# EAGLE design PidiBoy (EAGLE 9.2.0)
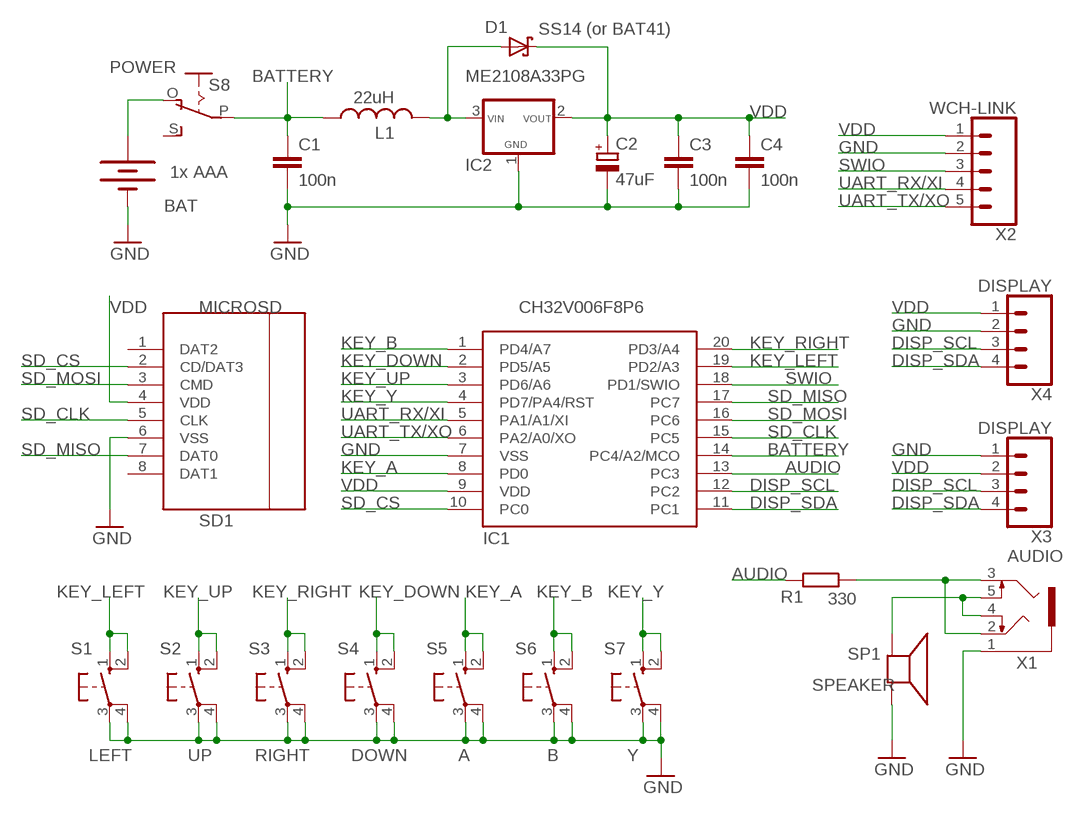
[diagram p0: schematic, sheet 1]

## Parts
BAT  1x AAA  BATTERY-AAA_KIT  [BATTERY-AAA-KIT]
C1  100n  C-EU050-024X044  [C050-024X044]
C2  47uF  CPOL-EUE2-5  [E2-5]
C3  100n  C-EU050-024X044  [C050-024X044]
C4  100n  C-EU050-024X044  [C050-024X044]
D1  SS14 (or BAT41)  SCHOTTKY-DIODEDO35-7  [DO35-7]
IC1  CH32V006F8P6  [TSSOP20]
IC2  ME2108A33PG  [SOT89-R]
L1  22uH  L-USWE-TPC  [POWER-CHOKE_WE-TPC]
R1  330  R-EU_0204/7  [0204/7]
S1  LEFT  10-XX  [B3F-10XX]
S2  UP  10-XX  [B3F-10XX]
S3  RIGHT  10-XX  [B3F-10XX]
S4  DOWN  10-XX  [B3F-10XX]
S5  A  10-XX  [B3F-10XX]
S6  B  10-XX  [B3F-10XX]
S7  Y  10-XX  [B3F-10XX]
S8  POWER  EG1218S  [EG1218]
SD1  MICROSD  [MICROSD]
SP1  SPEAKER  SPEAKER/AL60P  [AL60P]
X1  AUDIO  1503_09  [1503_09]
X2  WCH-LINK  CONN_05PTH_LONGPADS  [1X05_LONGPADS]
X3  DISPLAY  CONN_04  [1X04]
X4  DISPLAY  CONN_04  [1X04]

## Nets
AUDIO: IC1.13(PC3) R1.2
BATTERY: C1.1 IC1.14(PC4/A2/MCO) L1.1 S8.P
DISP_SCL: IC1.12(PC2) X3.3 X4.3
DISP_SDA: IC1.11(PC1) X3.4 X4.4
GND: BAT.GND@1(-) C1.2 C2.- C3.2 C4.2 IC1.7(VSS) IC2.1(GND) S1.3(P) S1.4(P1) S2.3(P) S2.4(P1) S3.3(P) S3.4(P1) S4.3(P) S4.4(P1) S5.3(P) S5.4(P1) S6.3(P) S6.4(P1) S7.3(P) S7.4(P1) SD1.6(VSS) SP1.2(-) X1.1 X2.2 X3.1 X4.2
KEY_A: IC1.8(PD0) S5.1(S) S5.2(S1)
KEY_B: IC1.1(PD4/A7) S6.1(S) S6.2(S1)
KEY_DOWN: IC1.2(PD5/A5) S4.1(S) S4.2(S1)
KEY_LEFT: IC1.19(PD2/A3) S1.1(S) S1.2(S1)
KEY_RIGHT: IC1.20(PD3/A4) S3.1(S) S3.2(S1)
KEY_UP: IC1.3(PD6/A6) S2.1(S) S2.2(S1)
KEY_Y: IC1.4(PD7/PA4/RST) S7.1(S) S7.2(S1)
N$2: SP1.1(+) X1.4 X1.5
N$3: BAT.PWR@1(+) S8.O
N$4: D1.A IC2.3(IN) L1.2
N$7: R1.1 X1.2 X1.3
SD_CLK: IC1.15(PC5) SD1.5(CLK)
SD_CS: IC1.10(PC0) SD1.2(CD/DAT3)
SD_MISO: IC1.17(PC7) SD1.7(DAT0)
SD_MOSI: IC1.16(PC6) SD1.3(CMD)
SWIO: IC1.18(PD1/SWIO) X2.3
UART_RX/XI: IC1.5(PA1/A1/XI) X2.4
UART_TX/XO: IC1.6(PA2/A0/XO) X2.5
VDD: C2.+ C3.1 C4.1 D1.C IC1.9(VDD) IC2.2(VOUT) SD1.4(VDD) X2.1 X3.2 X4.1
Unconnected: S8.S SD1.1(DAT2) SD1.8(DAT1)

## Library data of the parts
BAT = SparkFun-Batteries:BATTERY: Battery - Single Cell A variety of battery chemistries, sizes, and footprints. Device List: 20MM_PTH - Coin Cell Battery Holder - 20mm (PTH) <https://www.sparkfun.com/products/783> 6.8MM_PTH - Coin Cell Battery Holder - 6.8MM(SMD) <https://www.digikey.com/product-detail/en/seiko-instruments/MS621FE-FL11E/728-1057-ND/1889208?WT.srch=1&gclid=CNOQ5a6LzdQCFZS2wAodXCkE0g> 12MM_SMD - Coin Cell Battery Holder - 12mm (SMD) <https://www.sparkfun.com/products/10592> 12MM_PTH - Coin Cell Battery Holder - 12mm (PTH) <https://www.sparkfun.com/products/7948> 20MM_SMD - 20mm Coin Cell Battery Holder (SMD) (2 legs) Used on the Big Time Watch Kit <https://www.sparkfun.com/products/11734> 20MM_SMD_4LEGS - Coin Cell Battery Holder - 20mm (SMD) <https://www.sparkfun.com/products/11892> 20MM_SMD_4LEGS_OVERPASTE - Coin Cell Battery Holder - 20mm (SMD) <https://www.sparkfun.com/products/11892> (Over-paste on the legs) 24.5MM_PTH - Coin Cell Battery Holder - 24.5mm (PTH) <https://www.sparkfun.com/products/8863> 9V - 9V Battery Holder - PC Mount Used on the SparkFun SparkPunk Sound Kit <https://www.sparkfun.com/products/11177> and SparkFun SparkPunk Sequencer Kit <https://www.sparkfun.com/products/12707> 18650 - Battery Holder - 18650 (PTH) <https://www.sparkfun.com/products/13113> AA - Battery Holder - 1xAA (PTH) <https://www.sparkfun.com/products/7949> AAA - Battery Holder - 1xAAA (PTH) <https://www.sparkfun.com/products/12718> AA_KIT - Battery Holder - 1xAA (PTH) <https://www.sparkfun.com/products/7949> Special kit package - pads only have exposed copper on one side of the board. AAA_KIT - Battery Holder - 1xAAA (PTH) <https://www.sparkfun.com/products/12718> Special kit package - pads only have exposed copper on one side of the board.; PROD_ID: BATT-08571; SF_SKU: PRT-12718
C1 C3 C4 = rcl:C-EU: CAPACITOR, European symbol; SPICEPREFIX: C
C2 = rcl:CPOL-EU: POLARIZED CAPACITOR, European symbol; SPICEPREFIX: C
D1 = adafruit:SCHOTTKY-DIODE: Schottky Diode
IC1 = CH32V:CH32V006F8P6
IC2 = CH32V:ME2108A33PG
L1 = rcl:L-US: INDUCTOR, American symbol; SPICEPREFIX: L
R1 = rcl:R-EU_: RESISTOR, European symbol; SPICEPREFIX: R
S1-S7 = switch-omron:10-XX: OMRON SWITCH; MPN: B3F-1000; OC_FARNELL: 176432; OC_NEWARK: 36M3542
S8 = CH32V:EG1218: SLIDING SWITCH 0.1" spacing through hole, vertical SPDT slide switch http://www.ladyada.net/library/pcb/eaglelibrary.html
SD1 = Wuerth_Elektronik_eiCan_Communication_Connectors_v2.2:MICROSD: WR-CRD MICRO SD CARD CONNECTOR HINGE 8PINS
SP1 = adafruit_watch:SPEAKER: SPEAKER Source: Buerklin Added PS12 (for part # PS1240 piezo) http://www.ladyada.net/library/pcb/eaglelibrary.html
X1 = con-lumberg:1503_09: Jack connectors according to JISC 6560, 3.5 mm Klinkeneinbaukupplung nach JISC 6560, 3,5 mm, 3-polig/ stereo, abgewinkelte Ausführung, mit 2 Öffnern und Lötaugen, für Leiterplatten Rückseitenmontage Source: http://www.lumberg.com/Produkte/PDFs/1503_09.pdf; OC_FARNELL: 1243244; OC_NEWARK: unknown
X2 = SparkFun-Connectors:CONN_05: Multi connection point. Often used as Generic Header-pin footprint for 0.1 inch spaced/style header connections On any of the 0.1 inch spaced packages, you can populate with these: Break Away Headers - Straight <https://www.sparkfun.com/products/116> (PRT-00116) Break Away Male Headers - Right Angle <https://www.sparkfun.com/products/553> (PRT-00553) Female Headers <https://www.sparkfun.com/products/115> (PRT-00115) Break Away Headers - Machine Pin <https://www.sparkfun.com/products/117> (PRT-00117) Break Away Female Headers - Swiss Machine Pin <https://www.sparkfun.com/products/743> (PRT-00743) For SCREWTERMINALS and SPRING TERMINALS visit here: Screw Terimnals on SparkFun.com <https://www.sparkfun.com/search/results?term=Screw+Terminals> (5mm/3.5mm/2.54mm spacing) This device is also useful as a general connection point to wire up your design to another part of your project. Our various solder wires solder well into these plated through hole pads. Hook-Up Wire - Assortment (Stranded, 22 AWG) <https://www.sparkfun.com/products/11375> (PRT-11375) Hook-Up Wire - Assortment (Solid Core, 22 AWG) <https://www.sparkfun.com/products/11367> (PRT-11367) View the entire wire category on our website here <https://www.sparkfun.com/categories/141> Special notes: Molex polarized connector foot print use with SKU : PRT-08231 with associated crimp pins and housings. 1MM SMD Version SKU: PRT-10208
X3 X4 = SparkFun-Connectors:CONN_04: Multi connection point. Often used as Generic Header-pin footprint for 0.1 inch spaced/style header connections On any of the 0.1 inch spaced packages, you can populate with these: Break Away Headers - Straight <https://www.sparkfun.com/products/116> (PRT-00116) Break Away Male Headers - Right Angle <https://www.sparkfun.com/products/553> (PRT-00553) Female Headers <https://www.sparkfun.com/products/115> (PRT-00115) Break Away Headers - Machine Pin <https://www.sparkfun.com/products/117> (PRT-00117) Break Away Female Headers - Swiss Machine Pin <https://www.sparkfun.com/products/743> (PRT-00743) For SCREWTERMINALS and SPRING TERMINALS visit here: Screw Terimnals on SparkFun.com <https://www.sparkfun.com/search/results?term=Screw+Terminals> (5mm/3.5mm/2.54mm spacing) This device is also useful as a general connection point to wire up your design to another part of your project. Our various solder wires solder well into these plated through hole pads. Hook-Up Wire - Assortment (Stranded, 22 AWG) <https://www.sparkfun.com/products/11375> (PRT-11375) Hook-Up Wire - Assortment (Solid Core, 22 AWG) <https://www.sparkfun.com/products/11367> (PRT-11367) View the entire wire category on our website here <https://www.sparkfun.com/categories/141> Special notes: Molex polarized connector foot print use with SKU : PRT-08231 with associated crimp pins and housings. 1MM SMD Version SKU: PRT-10208; PROD_ID: CONN-09696

## Board
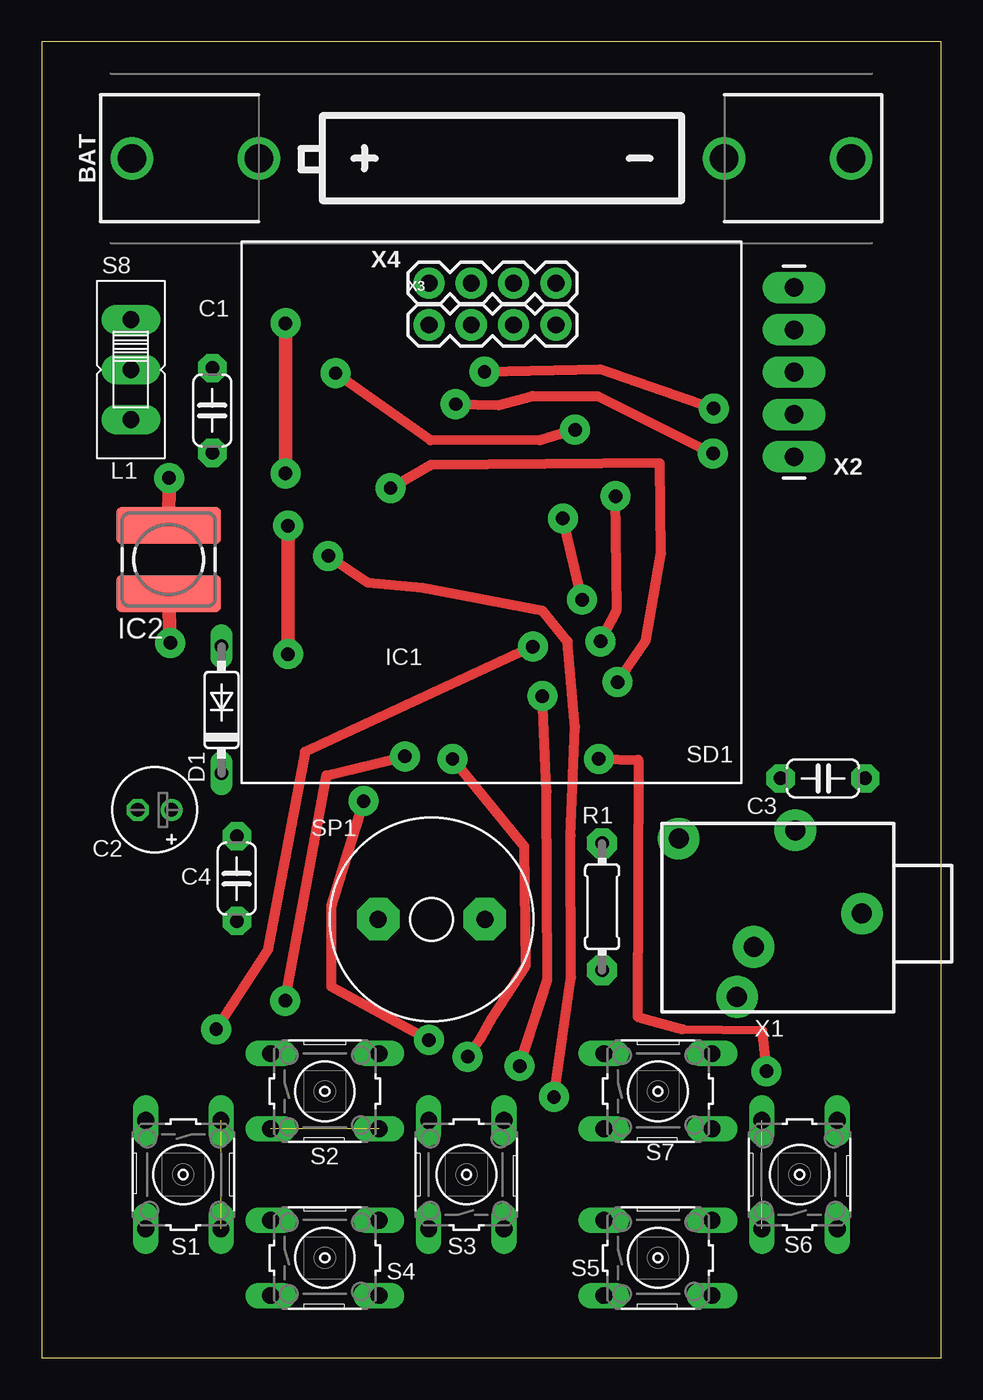
[diagram p1: board, top side]
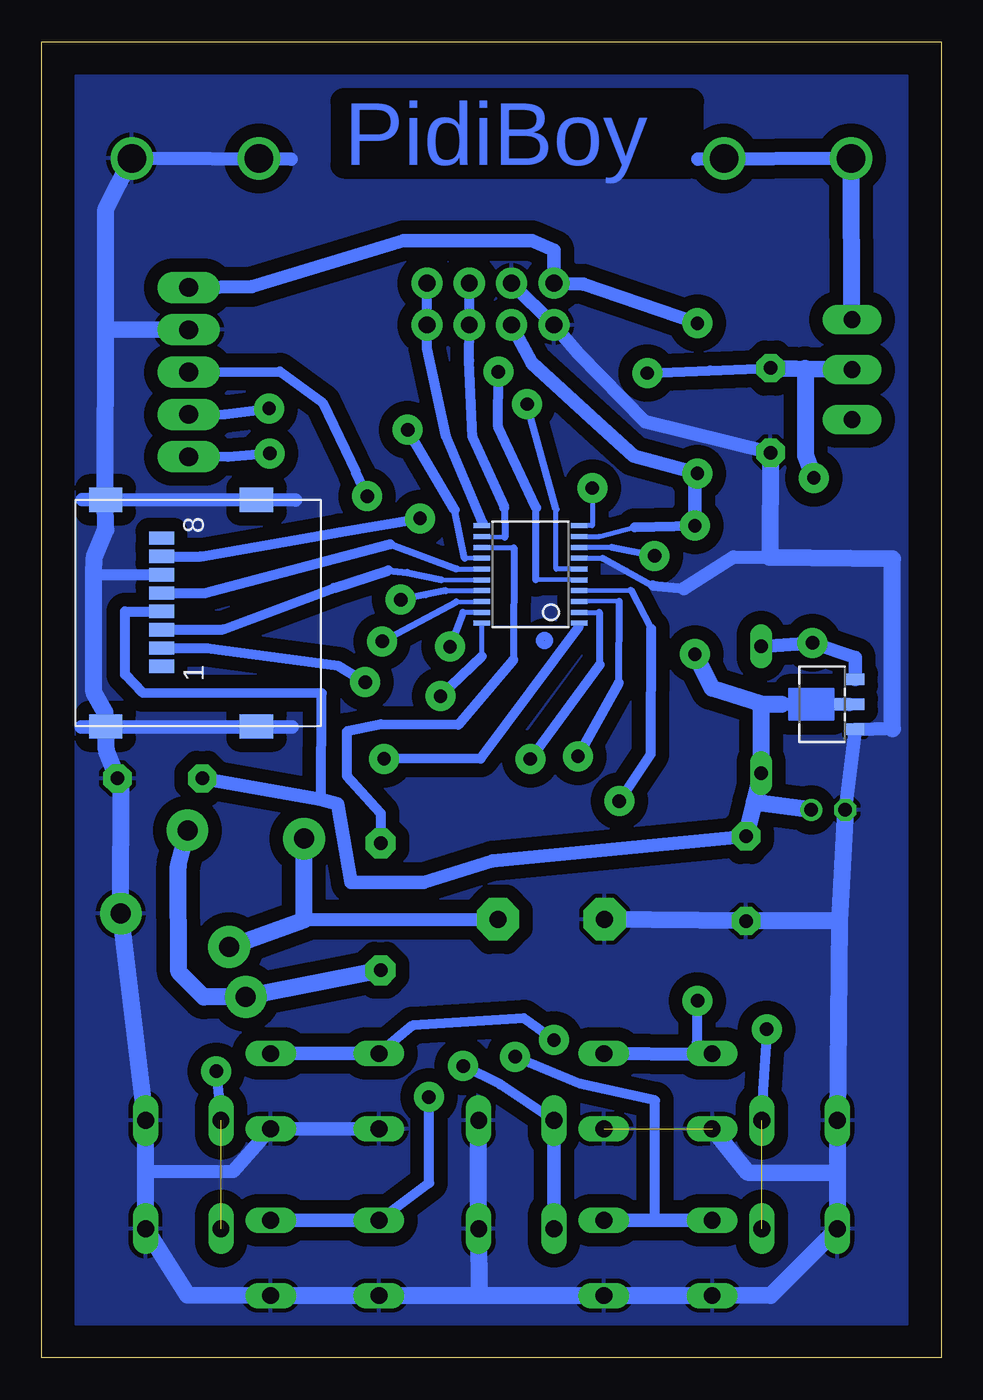
[diagram p2: board, bottom side, seen from below]

Size 54 x 79 mm. Coordinates in mm from the lower left corner, seen from the top.
Outline: 0,0 54,0 54,79 0,79 0,0
Copper layers (1*16): Top 0.035mm / dielectric 1.5mm / Bottom 0.035mm
Design rules "default": minimum track width 6mil, minimum drill 0.35mm, track to track 6mil, track to pad 6mil, pad to pad 6mil, via to via 6mil, smd to smd 6mil, copper to edge 40mil, drill to drill 6mil, minimum pad ring 10mil, minimum via ring 8mil, stop-mask expansion 4mil, vias tented up to drill 0mil, thermal gap 10mil

### Footprints (pad centres in the part's own frame; a part is rotated, then mirrored left to right if it is on the bottom)
BATTERY-AAA-KIT = drill 1.702: GND@1 21.59,0; GND@2 13.97,0; PWR@1 -21.59,0; PWR@2 -13.97,0
C050-024X044 = drill 0.813 pad 1.7 octagon: 1 -2.54,0; 2 2.54,0
E2-5 = drill 0.813 pad 1.27: + -1.016,0 | drill 0.813 pad 1.27 octagon: - 1.016,0
DO35-7 = drill 0.813 long: A 3.81,0; C -3.81,0
TSSOP20 = smd 0.305 x 0.991: 1 -2.925,-2.918; 2 -2.275,-2.918; 3 -1.625,-2.918; 4 -0.975,-2.918; 5 -0.325,-2.918; 6 0.325,-2.918; 7 0.975,-2.918; 8 1.625,-2.918; 9 2.275,-2.918; 10 2.925,-2.918; 11 2.925,2.918; 12 2.275,2.918; 13 1.625,2.918; 14 0.975,2.918; 15 0.325,2.918; 16 -0.325,2.918; 17 -0.975,2.918; 18 -1.625,2.918; 19 -2.275,2.918; 20 -2.925,2.918
SOT89-R = smd 0.7 x 1.1: 1 -1.5,-1.75; 3 1.5,-1.75 | smd 0.7 x 1.8: 2 0,-1.4
POWER-CHOKE_WE-TPC = smd 6.3 x 2.2: 1 0,2.05; 2 0,-2.05
0204/7 = drill 0.813 pad 1.8 octagon: 1 -3.81,0; 2 3.81,0
B3F-10XX = drill 1.016 long: 1 -3.251,2.261; 2 3.251,2.261; 3 -3.251,-2.261; 4 3.251,-2.261
EG1218 = drill 1 pad 1.778 long: O -3,0; P 0,0; S 3,0
MICROSD = smd 0.8 x 1.5: 1 2.62,-2.54; 2 1.52,-2.54; 3 0.42,-2.54; 4 -0.68,-2.54; 5 -1.78,-2.54; 6 -2.88,-2.54; 7 -3.98,-2.54; 8 -5.08,-2.54 | smd 1.45 x 2: Z1 -7.38,3.16; Z2 6.22,3.16; Z3 -7.38,-5.89; Z4 6.22,-5.89
AL60P = drill 1.016 pad 2.54 octagon: 1 -3.2,0; 2 3.2,0
1503_09 = drill 1.2 pad 2.5: 1 0,-2; 2 -5,-6; 3 5,-9.5; 4 -4.5,-13; 5 2,-8.5
1X05_LONGPADS = drill 1.118 pad 1.88 long: 1 0,0; 2 2.54,0; 3 5.08,0; 4 7.62,0; 5 10.16,0
1X04 = drill 1.016 pad 1.88: 1 0,0; 2 2.54,0; 3 5.08,0; 4 7.62,0

### Placement (x,y rotation side)
BAT  27,72 0 top
C1  10.24,56.87 270 top
C2  6.78,32.9 180 top
C3  46.9,34.78 0 top
C4  11.71,28.76 270 top
D1  10.8,38.89 90 top
IC1  24.65,47.02 90 bottom
IC2  6.9,39.22 90 bottom
L1  7.63,47.91 0 top
R1  33.65,27.08 90 top
S1  8.5,11 270 top
S2  17,16 0 top
S3  25.5,11 90 top
S4  17,6 0 top
S5  37,6 0 top
S6  45.5,11 90 top
S7  37,16 0 top
S8  5.35,59.31 270 top
SD1  44.26,44.12 270 bottom
SP1  23.4,26.32 180 top
X1  51.25,26.66 270 top
X2  45.17,64.24 270 top
X3  23.25,62 0 top
X4  23.25,64.5 0 top

### Tracks (layer width: path | path; a pad name or v marks a point on that pad's centre or on a via)
AUDIO
  Bottom 0.305: IC1.13 25.65,48.63
  Bottom 0.406: 25.65,48.63 25.68,41.91
  Bottom 0.61: 25.68,41.91 29,38 33.62,38.02 35.68,37.58 35.69,34.95 33.65,32.7 R1.2
BATTERY  (via drill 0.8 pad 1.8)
  Top 0.61: v32.03,55.7 29.89,55.07 23.33,55.07 v17.65,59.1
  Top 0.813: v7.65,52.82 L1.1
  Bottom 0.305: IC1.14 28.61,47.99
  Bottom 0.406: 28.61,47.99 29.21,50.91
  Bottom 0.61: 29.21,50.91 v32.03,55.7 | v17.65,59.1 13.87,59.26 C1.1
  Bottom 0.813: S8.P 8.16,59.39
  Bottom 1.016: C1.1 S8.P | 8.16,59.39 8.15,54.14 v7.65,52.82
DISP_SCL
  Bottom 0.305: IC1.12 26.19,49.26 26.16,49.26
  Bottom 0.406: 26.22,51.02 26.19,49.26
  Bottom 0.61: 26.22,51.02 28.13,55.24 28.34,59.86 X3.3 X4.3
DISP_SDA
  Bottom 0.305: IC1.11 27.53,50.12
  Bottom 0.61: 27.53,50.12 29.74,55.31 30.87,60.62 X3.4 X4.4
GND  (1 unrouted)
  Bottom 0.305: IC1.7 20.31,48
  Bottom 0.406: 49.22,34.77 C3.2 | 20.31,48 17.32,46.36
  Bottom 0.61: 17.32,46.36 15.46,46.17
  Bottom 0.7: SD1.6 50.86,47
  Bottom 0.813: C1.2 17.8,56.2 21.77,60.27 X3.1 X4.2 | 2.92,37.76 IC2.1 C2.- | 47.76,11.17 42.52,11.21 S7.4 S7.3 | 15.46,46.17 12.47,48.06 10.29,48.05 | 38.96,37.87 50.16,37.87 51.63,37.87 | 38.77,51.49 50.17,51.52 51.56,51.52 | BAT.GND@1 39.02,71.94
  Bottom 1.016: C2.- 6.11,26.23 | 6.11,26.23 C4.2 SP1.2 | 2.92,37.76 2.92,47.96 10.29,48.05 C1.2 | 49.22,34.77 X1.1 S6.4 47.76,11.17 S6.3 45.24,3.75 S5.4 S5.3 27.73,3.73 | C3.2 50.11,36.49 50.16,37.87 50.19,38.74 50.87,39.95 50.86,47 50.84,48.07 50.15,49.71 50.17,51.52 50.19,52.45 50.16,61.68 | 6.11,26.23 S1.3 6.24,11.11 | 6.24,11.11 S1.4 10.23,3.75 S4.3 S4.4 27.73,3.73 | 27.73,3.73 S3.3 S3.4 | S2.3 11.62,11.14 6.24,11.11 | 50.16,61.68 50.15,68.95 BAT.GND@1 | X2.2 50.16,61.68
  pour Bottom (isolate 0.813): 2,2 2,77 52,77 52,2
KEY_A  (via drill 0.8 pad 1.8)
  Top 0.61: v30.75,15.65 31.78,22.82 31.75,31.33 32.02,37.88 31.58,43.01 30.1,44.82 22.86,46.2 19.6,46.52 v17.21,48.13
  Bottom 0.305: 19.79,48.64 IC1.8
  Bottom 0.406: v17.21,48.13 19.79,48.64
  Bottom 0.61: S5.1 30.74,10.5 v30.75,15.65
  Bottom 0.813: S5.1 S5.2
KEY_B  (via drill 0.8 pad 1.8)  (1 unrouted)
  Top 0.508: 38.48,19.72 43.24,19.65
  Top 0.61: v33.44,35.96 35.81,35.9 35.77,20.47 38.48,19.72 | 43.24,19.65 v43.52,17.2
  Bottom 0.305: IC1.1 21.76,43.9
  Bottom 0.61: 21.76,43.9 27.64,35.97 v33.44,35.96 | v43.52,17.2 S6.2
KEY_DOWN  (via drill 0.8 pad 1.8)
  Top 0.61: v24.66,35.94 28.96,30.7 29.04,23.5 27.04,20.42 26.37,19.21 v25.58,18.08
  Bottom 0.305: IC1.2 20.52,44.74
  Bottom 0.406: 20.52,44.74 20.52,41.59
  Bottom 0.61: 17.18,8.26 17.18,15.44 21.68,16.45 v25.58,18.08 | 20.52,41.59 v24.66,35.94
  Bottom 0.813: S4.2 17.18,8.26 S4.1
KEY_LEFT  (via drill 0.8 pad 1.8)  (1 unrouted)
  Top 0.61: v29.49,42.69 15.8,36.37 13.56,24.45 v10.48,19.73
  Bottom 0.305: IC1.19 28.71,44.74
  Bottom 0.406: 28.71,44.74 v29.49,42.69
  Bottom 0.61: v10.48,19.73 10.7,16.07 S1.1
KEY_RIGHT  (via drill 0.8 pad 1.8)
  Top 0.61: v28.69,17.51 30.36,22.69 30.31,34.01 v30.05,39.72
  Bottom 0.305: 27.57,42.1 IC1.20
  Bottom 0.61: S3.2 26.47,16.41 v28.69,17.51 | v30.05,39.72 27.57,42.1
  Bottom 0.813: S3.2 S3.1
KEY_UP  (via drill 0.8 pad 1.8)
  Top 0.61: v14.62,21.43 17.09,34.97 v21.8,36.1
  Bottom 0.305: 19.33,45.41 IC1.3
  Bottom 0.406: 19.35,40.51 19.33,45.41
  Bottom 0.61: S2.1 14.7,18.22 v14.62,21.43 | v21.8,36.1 19.35,40.51
  Bottom 0.813: S2.2 14.7,18.22
KEY_Y  (via drill 0.8 pad 1.8)
  Top 0.61: v19.33,33.42 17.39,27.13 17.39,22.29 v23.24,19.08
  Bottom 0.305: IC1.4 18.63,46.07
  Bottom 0.406: 18.63,46.07 17.42,43.76
  Bottom 0.61: 17.42,43.76 17.45,36.23 v19.33,33.42 | v23.24,19.08 25.06,20.38 31.73,19.95 S7.1
  Bottom 0.813: S7.2 S7.1
N$2
  Bottom 0.813: SP1.1 38.23,26.3
  Bottom 1.016: X1.4 38.23,26.3 X1.5
N$3
  Bottom 0.813: BAT.PWR@1 14.6,71.94
  Bottom 1.016: S8.O BAT.PWR@1
N$4  (via drill 0.8 pad 1.8)
  Top 0.813: L1.2 v7.73,42.92
  Bottom 0.813: IC2.3 5.17,42.04 v7.73,42.92 D1.A
N$7
  Bottom 1.016: R1.1 X1.3 44.27,21.65 45.76,23.17 45.8,29.51 X1.2
SD_CLK
  Bottom 0.305: 29.07,47.35 IC1.15
  Bottom 0.406: 33.08,48.84 29.07,47.35
  Bottom 0.61: SD1.5 44.2,45.9 36.97,47.82 33.08,48.84
SD_CS  (via drill 0.8 pad 1.8)
  Top 0.61: v34.58,40.56 36.27,43.05 37.18,48.27 37.11,53.7 23.37,53.59 21.66,52.6 v20.94,52.2
  Bottom 0.305: v20.94,52.2 20.94,49.95 IC1.10
  Bottom 0.61: SD1.2 44.05,42.6 36.22,41.55 v34.58,40.56
SD_MISO  (via drill 0.8 pad 1.8)
  Top 0.61: v32.45,45.5 31.71,48.6 v31.29,50.39
  Bottom 0.305: 29.73,46.05 IC1.17
  Bottom 0.406: 29.73,46.05 30.93,45.8 v32.45,45.5
  Bottom 0.61: SD1.7 44.47,48.1 36.1,49.56 v31.29,50.39
SD_MOSI
  Bottom 0.305: 30.02,46.7 IC1.16
  Bottom 0.406: 33.2,47.27 32.06,47.15 30.02,46.7
  Bottom 0.61: SD1.3 43.1,43.73 36.46,46.21 33.2,47.27
SWIO  (via drill 0.8 pad 1.8)
  Top 0.61: v33.56,43.01 34.53,44.88 v34.46,51.71
  Bottom 0.305: 29.11,45.37 IC1.18
  Bottom 0.406: v33.56,43.01 29.11,45.37
  Bottom 0.61: v34.46,51.71 35.13,53.13 37.14,57.33 39.69,59.2 X2.3
UART_RX/XI  (via drill 0.8 pad 1.8)
  Top 0.61: v26.59,59.19 33.52,59.33 v40.34,56.98
  Bottom 0.305: IC1.5 24.33,46.7
  Bottom 0.406: 24.33,46.7 24.31,51.02
  Bottom 0.61: 24.31,51.02 26.6,55.89 v26.59,59.19 | X2.4 42.99,56.64 v40.34,56.98
UART_TX/XO  (via drill 0.8 pad 1.8)
  Top 0.61: v24.85,57.24 27.43,57.18 29.45,57.73 33.4,57.72 v40.3,54.29
  Bottom 0.305: IC1.6 23.11,47.34 23.12,50.94
  Bottom 0.406: 23.12,50.94 v24.85,57.24
  Bottom 0.61: v40.3,54.29 42.81,54.08 X2.5
VDD  (via drill 0.8 pad 1.8)
  Top 0.813: v14.78,49.95 v14.79,42.24 | v14.64,62.1 v14.64,53.08
  Bottom 0.305: IC1.9 20.54,49.3 18.4,49.86
  Bottom 0.61: SD1.4 48.98,44.81 48.99,41.01 47.93,39.92 37.2,39.89 37.22,33.5 | 18.4,49.86 v14.78,49.95
  Bottom 0.813: X3.2 24.57,59.69 20.67,56.13 18.44,54.12 14.78,53.13 | C3.1 37.22,33.5 36.24,33.25 35.41,28.55 31.06,28.55 26.92,29.82 C4.1 | X2.1 41.39,64.31 32.28,67.05 24.57,67.04 23.24,66.47 X4.1 21.48,64.45 v14.64,62.1 | 14.78,53.13 v14.78,49.95 | 14.78,53.13 v14.64,53.08 | 9.57,39.24 IC2.2
  Bottom 1.016: 11.22,33.34 D1.C 10.81,39.23 | 11.22,33.34 C4.1 | C2.+ 11.22,33.34 | 10.81,39.23 13.74,40.18 v14.79,42.24 | 10.81,39.23 9.57,39.24
(copper drawn outside any net)
  shapes: Bottom circle x1

### Text on the board
Bottom: PidiBoy
Document: VCC-GND | VCC | GND-VCC